# EAGLE design attinier84-motherboard-mk-3.0 (EAGLE 6.5.0)
REVISION: 3.0
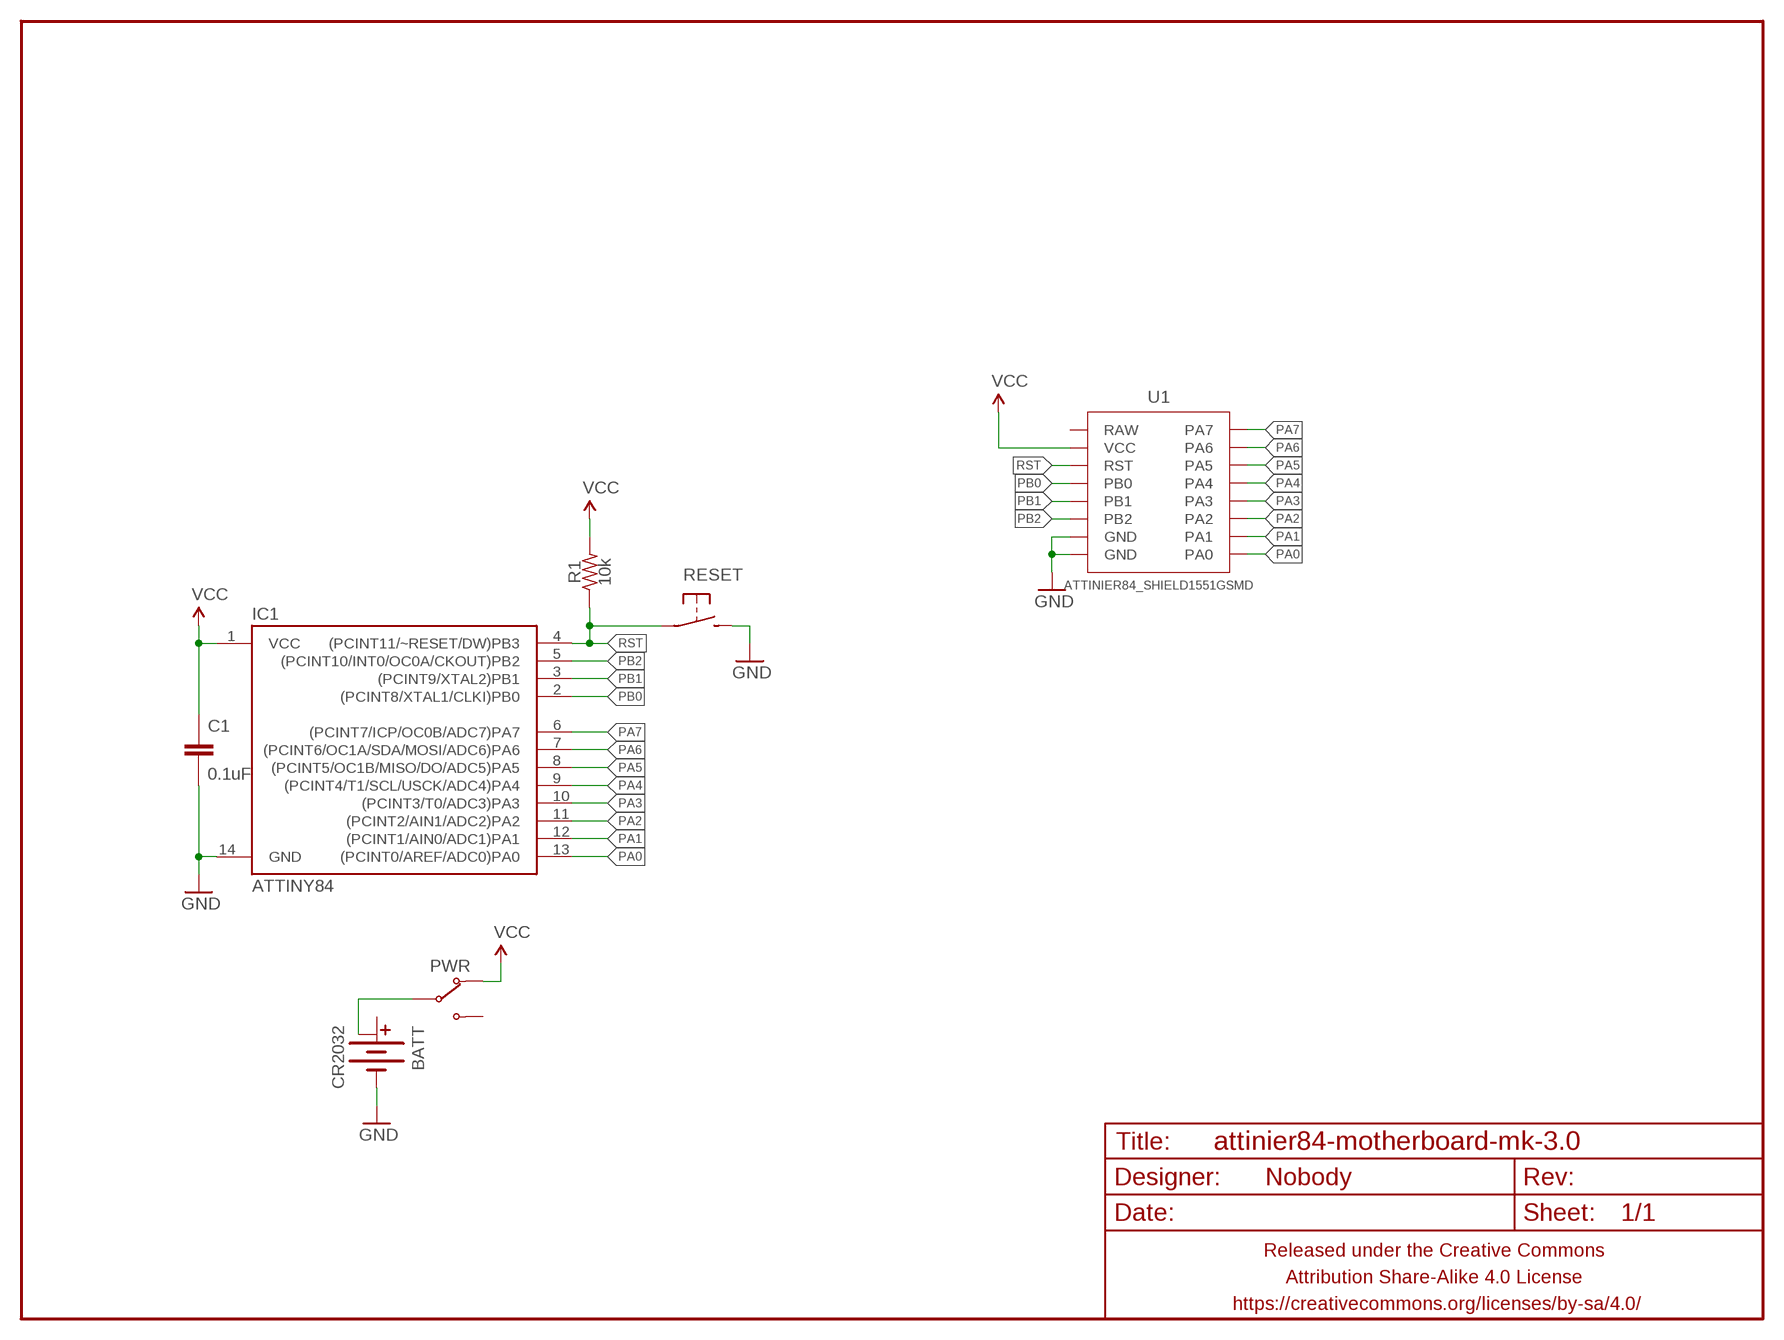
[diagram p0: schematic, sheet 1]

## Parts
BATT  CR2032  BATTERY-COINCR2032_SMD  [BATTCON_20MM_MINE]
C1  0.1uF  CAPACITOR-CERAMICC0805  [C0805]
FRAME1  FRAME-LETTERNO_PACKAGE  [DUMMY]
IC1  ATTINY84  [SO14]
PWR  SWITCH-SPDTPTH-RA-2.54MM  [SPDT-RA-2.54MM]
R1  10k  RESISTORR0805  [R0805]
RESET  SPST-NO-TACT3MM-RA  [TACTILE-PTH-SIDE]
U1  ATTINIER84_SHIELD1551GSMD  [ATTINIER84_SHIELD2_SMD]

## Nets
GND: BATT.BOTTOM(-) C1.2 IC1.14(GND) RESET.2 U1.GND@1(GND) U1.GND@2(GND)
N$1: BATT.TOP@2(+1) PWR.2(COM)
PA0: IC1.13((PCINT0/AREF/ADC0)PA0) U1.PA0
PA1: IC1.12((PCINT1/AIN0/ADC1)PA1) U1.PA1
PA2: IC1.11((PCINT2/AIN1/ADC2)PA2) U1.PA2
PA3: IC1.10((PCINT3/T0/ADC3)PA3) U1.PA3
PA4: IC1.9((PCINT4/T1/SCL/USCK/ADC4)PA4) U1.PA4
PA5: IC1.8((PCINT5/OC1B/MISO/DO/ADC5)PA5) U1.PA5
PA6: IC1.7((PCINT6/OC1A/SDA/MOSI/ADC6)PA6) U1.PA6
PA7: IC1.6((PCINT7/ICP/OC0B/ADC7)PA7) U1.PA7
PB0: IC1.2((PCINT8/XTAL1/CLKI)PB0) U1.PB0
PB1: IC1.3((PCINT9/XTAL2)PB1) U1.PB1
PB2: IC1.5((PCINT10/INT0/OC0A/CKOUT)PB2) U1.PB2
RST: IC1.4((PCINT11/~RESET/DW)PB3) R1.1 RESET.1 U1.RST
VCC: C1.1 IC1.1(VCC) PWR.1(NC) R1.2 U1.VCC
Unconnected: BATT.TOP@1(+) PWR.3(NO) U1.RAW

## Library data of the parts
BATT = A_butts:BATTERY-COIN
C1 = A_butts:CAPACITOR-CERAMIC: CAPACITOR, European symbol
FRAME1 = A_butts:FRAME-LETTER: Schematic Frame Standard 8.5x11 US Letter frame; DESIGNER: Nobody
IC1 = A_butts:ATTINY84: Atmel 14-pin 2/4/8kB flash uC
PWR = A_butts:SWITCH-SPDT
R1 = A_butts:RESISTOR: RESISTOR, American symbol
RESET = A_butts:SPST-NO-TACT
U1 = A_butts:ATTINIER84_SHIELD

## Board
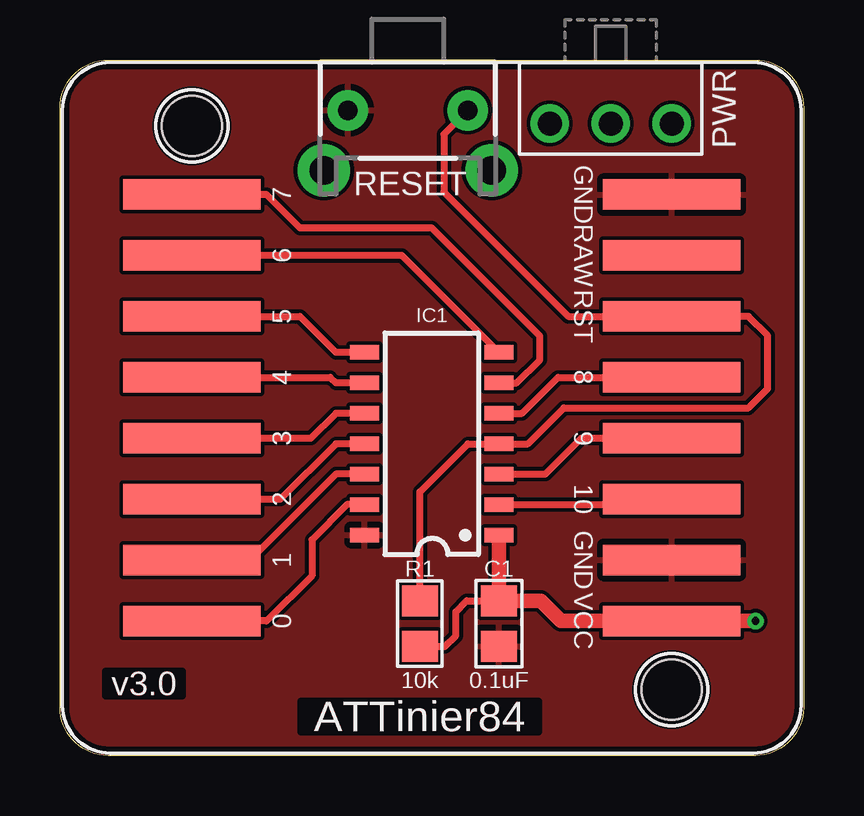
[diagram p1: board, top side]
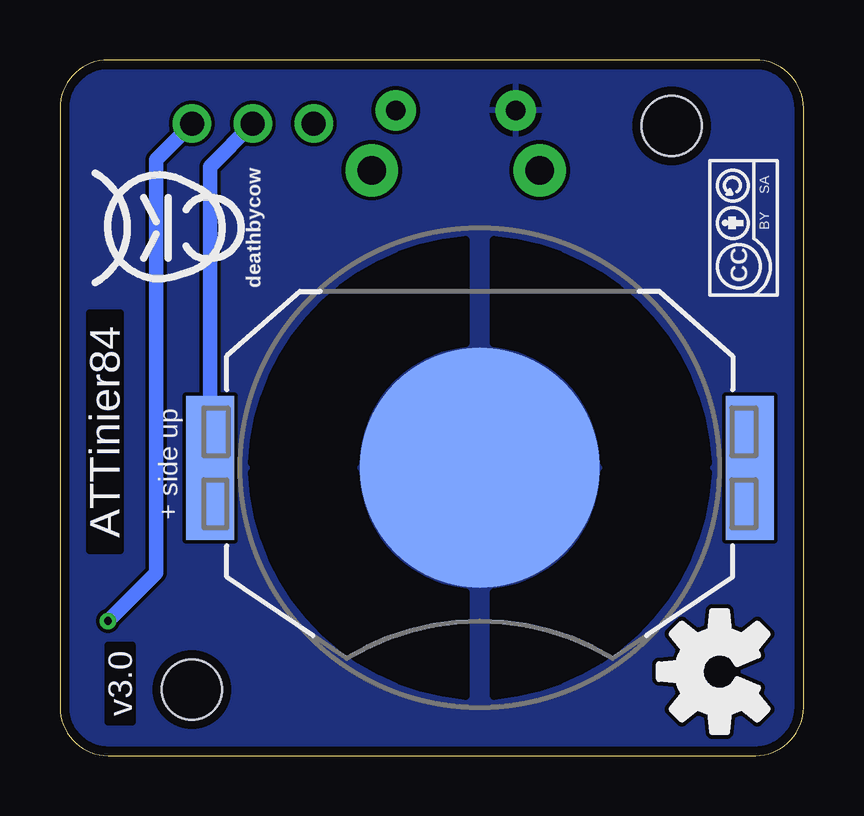
[diagram p2: board, bottom side, seen from below]

Size 31 x 29 mm. Coordinates in mm from the lower left corner, seen from the top.
Copper layers (1*16): Top 0.0356mm / dielectric 1.5011mm / Bottom 0.0356mm
Design rules "LaenPCBOrder_2": minimum track width 6mil, minimum drill 13mil, track to track 6mil, track to pad 6mil, pad to pad 6mil, via to via 6mil, smd to smd 6mil, copper to edge 15mil, drill to drill 6mil, minimum pad ring 7mil, minimum via ring 7mil, stop-mask expansion 3mil, vias tented up to drill 20mil, thermal gap 10mil

### Footprints (pad centres in the part's own frame; a part is rotated, then mirrored left to right if it is on the bottom)
BATTCON_20MM_MINE = smd 10 x 10: BOTTOM 0,0 | smd 6 x 2: TOP@1 0,11.25; TOP@2 0,-11.25
C0805 = smd 1.3 x 1.5: 1 -0.95,0; 2 0.95,0
SO14 = smd 0.6 x 1.2: 1 -3.81,-2.8; 2 -2.54,-2.8; 3 -1.27,-2.8; 4 0,-2.8; 5 1.27,-2.8; 6 2.54,-2.8; 7 3.81,-2.8; 8 3.81,2.8; 9 2.54,2.8; 10 1.27,2.8; 11 0,2.8; 12 -1.27,2.8; 13 -2.54,2.8; 14 -3.81,2.8
SPDT-RA-2.54MM = drill 1 pad 1.6: 1 0,0; 2 2.54,0; 3 5.08,0
R0805 = smd 1.3 x 1.5: 1 -0.95,0; 2 0.95,0
TACTILE-PTH-SIDE = drill 0.8 pad 1.7: 1 -2.5,0; 2 2.5,0 | drill 1.2 pad 2.2: ANCHOR1 -3.5,2.5; ANCHOR2 3.5,2.5
ATTINIER84_SHIELD2_SMD = smd 5.715 x 1.27: GND@1 10,8.89; GND@2 10,-6.35; PA0 -10,-8.89; PA1 -10,-6.35; PA2 -10,-3.81; PA3 -10,-1.27; PA4 -10,1.27; PA5 -10,3.81; PA6 -10,6.35; PA7 -10,8.89; PB0 10,-3.81; PB1 10,-1.27; PB2 10,1.27; RAW 10,6.35; RST 10,3.81; VCC 10,-8.89 | hole 2.5: -10,11.75; 10,-11.75

### Placement (x,y rotation side)
BATT  13.5,12 270 bottom
C1  18.3,5.5 270 top
FRAME1  0,0 0 top
IC1  15.5,13 90 top
PWR  25.5,26.35 180 top
R1  15,5.5 270 top
RESET  14.5,26.9 180 top
U1  15.5,14.5 0 top
U$1  [CC-BY-SA-4.0-NO-URL]  2.5,22 90 bottom
U$2  [COW_SMALL]  27,22 90 bottom
U$4  [OSHWLOGO_BOT_0.2_A]  3.5,3.5 270 top

### Tracks (layer width: path | path; a pad name or v marks a point on that pad's centre or on a via)
GND
  pour Bottom: -0.1,-0.1 -0.1,29.1 31.1,29.1 31.1,-0.1
  pour Top: -0.1,-0.1 -0.1,29.1 31.1,29.1 31.1,-0.1
N$1
  Bottom 0.6: BATT.TOP@2 24.75,24.56 PWR.2
PA0
  Top 0.3: IC1.13 11.96,10.46 10.5,9 10.5,7.5 8.61,5.61 U1.PA0
PA1
  Top 0.3: IC1.12 11.5,11.73 7.92,8.15 U1.PA1
PA2
  Top 0.3: IC1.11 11.5,13 9.19,10.69 U1.PA2
PA3
  Top 0.3: IC1.10 11.5,14.27 10.46,13.23 U1.PA3
PA4
  Top 0.3: IC1.9 11.5,15.54 11.27,15.77 U1.PA4
PA5
  Top 0.3: IC1.8 11.5,16.81 10,18.31 U1.PA5
PA6
  Top 0.3: U1.PA6 14.26,20.85 IC1.7
PA7
  Top 0.3: IC1.6 19.04,15.54 20,16.5 20,17.5 15.5,22 10,22 8.61,23.39 U1.PA7
PB0
  Top 0.3: IC1.2 25.27,10.46 U1.PB0
PB1
  Top 0.3: IC1.3 20.23,11.73 21.73,13.23 U1.PB1
PB2
  Top 0.3: IC1.5 19.27,14.27 20.77,15.77 U1.PB2
RST
  Top 0.3: R1.1 15,11 17,13 IC1.4 19.5,13 21,14.5 28.7,14.5 29.5,15.3 29.5,17.51 28.7,18.31 U1.RST 21.19,18.31 16,23.5 16,25.9 RESET.1
VCC  (via drill 0.33)
  Top 0.3: R1.2 16.05,4.55 16.5,5 16.5,6 16.95,6.45 C1.1
  Top 0.6: IC1.1 C1.1 20.05,6.45 20.89,5.61 U1.VCC v29,5.61
  Bottom 0.6: PWR.1 27,24.85 27,7.61 v29,5.61

### Text on the board
Top: ATTinier84
Bottom: ATTinier84
tPlace: ATTinier84
bPlace: ATTinier84 | + side up